# EAGLE design working (EAGLE 9.6.2)
COMPANY: ADAFRUIT INDUSTRIES; DRAWN: KTOWN; REV: A
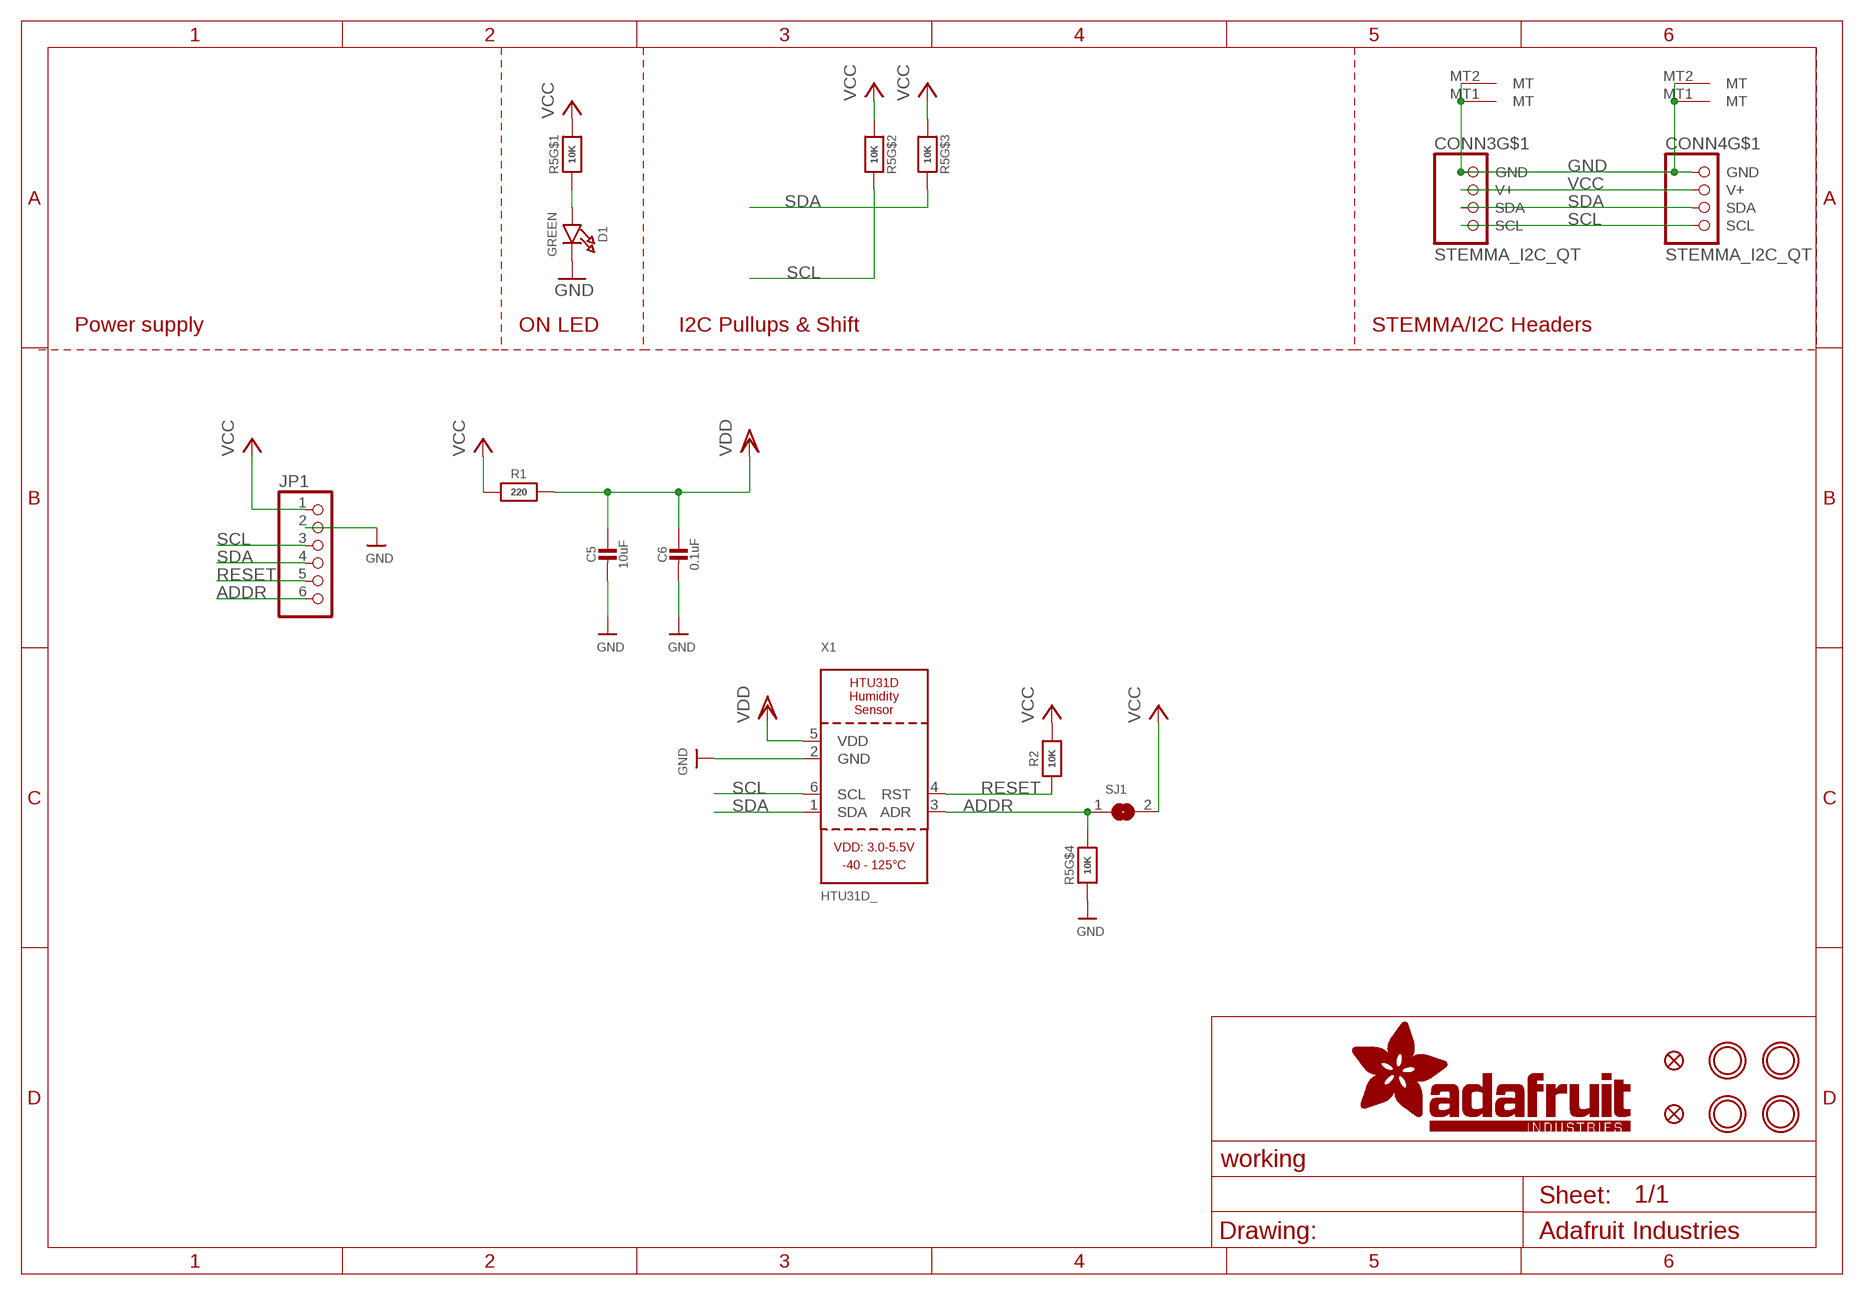
[diagram p0: schematic, sheet 1]

## Parts
C5  10uF  CAP_CERAMIC0805-NOOUTLINE  [0805-NO]
C6  0.1uF  CAP_CERAMIC0603_NO  [0603-NO]
CONN3  STEMMA_I2C_QT  [JST_SH4]
CONN4  STEMMA_I2C_QT  [JST_SH4]
D1  GREEN  LED0603_NOOUTLINE  [CHIPLED_0603_NOOUTLINE]
FID3  FIDUCIAL_1MM  [FIDUCIAL_1MM]
FID4  FIDUCIAL_1MM  [FIDUCIAL_1MM]
JP1  HEADER-1X670MIL  [1X06_ROUND_70]
R1  220  RESISTOR_0603_NOOUT  [0603-NO]
R2  10K  RESISTOR_0603_NOOUT  [0603-NO]
R5  10K  RESISTOR_4PACK  [RESPACK_4X0603]
SJ1  SOLDERJUMPER  [SOLDERJUMPER_ARROW_NOPASTE]
U$19  MOUNTINGHOLE2.5  [MOUNTINGHOLE_2.5_PLATED]
U$20  MOUNTINGHOLE2.5  [MOUNTINGHOLE_2.5_PLATED]
U$22  MOUNTINGHOLE2.5  [MOUNTINGHOLE_2.5_PLATED]
U$25  MOUNTINGHOLE2.5  [MOUNTINGHOLE_2.5_PLATED]
X1  HTU31D_  [HTU31D]

## Nets
ADDR: JP1.6 R5.5 SJ1.1 X1.3(ADR)
GND: C5.2 C6.2 CONN3.1(GND) CONN3.MT1(MT) CONN3.MT2(MT) CONN4.1(GND) CONN4.MT1(MT) CONN4.MT2(MT) D1.C JP1.2 R5.4 X1.2(GND)
N$1: D1.A R5.1
RESET: JP1.5 R2.1 X1.4(RST)
SCL: CONN3.4(SCL) CONN4.4(SCL) JP1.3 R5.7 X1.6(SCL)
SDA: CONN3.3(SDA) CONN4.3(SDA) JP1.4 R5.6 X1.1(SDA)
VCC [highpower]: CONN3.2(V+) CONN4.2(V+) JP1.1 R1.1 R2.2 R5.2 R5.3 R5.8 SJ1.2
VDD: C5.1 C6.1 R1.2 X1.5(VDD)

## Notes on the sheet
- Power supply | ON LED | I2C Pullups & Shift | STEMMA/I2C Headers

## Library data of the parts
C5 C6 = microbuilder:CAP_CERAMIC: Ceramic Capacitors For new designs, use the packages preceded by an '_' character since they are more reliable: The following footprints should be used on most boards: _0402 - Standard footprint for regular board layouts _0603 - Standard footprint for regular board layouts _0805 - Standard footprint for regular board layouts _1206 - Standard footprint for regular board layouts For extremely tight-pitch boards where space is at a premium, the following 'micro-pitch' footprints can be used (smaller pads, no silkscreen outline, etc.): _0402MP - Micro-pitch footprint for very dense/compact boards _0603MP - Micro-pitch footprint for very dense/compact boards _0805MP - Micro-pitch footprint for very dense/compact boards _1206MP - Micro-pitch footprint for very dense/compact boards
CONN3 CONN4 = microbuilder:STEMMA_I2C
D1 = microbuilder:LED: LED 0603 - 0603 Surface Mount Package 2mA: Green LED - Low Power (3.9mcd, 2ma, 1.7Vf) - Digikey: 475-2709-2-ND Orange LED - Low Power (9.8mcd, 2ma, 1.8Vf) - Digikey: 475-1194-2-ND Red LED - Low Power (5mcd, 2ma, 1.8Vf) - Digikey: 475-1195-2-ND Yellow LED - Low Power (7mcd, 2ma, 1.8Vf) - Digikey: 475-1196-2-ND 5mA: Blue LED - Low Power (17mcd, 5ma, 2.9Vf) - Digikey: LNJ937W8CRACT-ND 0805 - 0805 Surface Mount Package 2mA: Red LED (8.8mcd, 2mA, 1.8Vf, Clear) - Low Power [Digikey: 475-2510-1-ND] Green LED (5mcd, 2mA, 1.8Vf, Clear) - Low Power [Digikey: 475-2730-1-ND] Yellow LED (11.3mcd, 2mA, 1.8Vf, Clear) - Low Power [Digikey: 475-2555-1-ND] 20mA: Red LED (104mcd, 20mA, Diffused) - LS R976 [Digikey: 475-1278-6-ND] Red LED (12mcd, 20mA, 2.0Vf, Clear) - APT2012EC [Digikey: 754-1128-1-ND] Green LED (15mcd, 20mA, 2.2Vf, Clear) - APT2012GC [Digikey: 754-1131-1-ND] Orange LED (160mcd, 20mA, 2.1Vf, Clear) - APT2012SECK [Digikey: 754-1130-1-ND] 1206 - 1206 Surface Mount Package Green LED (26mcd, 20mA, Diffused) - LG N971 [Digikey: 475-1407-6-ND] Red LED (15mcd, 20mA, Diffused) - LH N974 [Digikey: 475-1416-6-ND] Cree - Cree High-Power Surface Mount LEDs XPEBWT-L1-0000-00D50 - White 111lm 350mA 2.9Vf 6200K 110° XTEAWT-00-0000-00000LEE3 - White 114lm 350mA 2.85Vf 5000K 115° Everlight - Everlight 45-21 Series Surface Mount LEDs 45-21/QK2C-B2832AC2CB2/2T - Warm White 2000mcd 20mA 3.25Vf 3050K 120° 45-21/LK2C-B38452C4CB2/2T - Nuetral White 2000mcd 20mA 3.25Vf 4150K 120° 45-21/LK2C-B50634C6CB2/2T - Cold White 2200mcd 20mA 3.25Vf 5650K 120° PLCC2 Reverse Mount LS T77K-J1L2-1-0-2-R18-Z - Red 11.25mcd 2mA 1.8Vf 630nm 120° LO T77K-L1M2-24-Z - Orange 19.6mcd 2mA 1.8Vf 606nm 120° LY T77K-K2M1-26-Z - Yellow 15.7mcd 2mA 1.8Vf 587nm 120°
FID3 FID4 = microbuilder:FIDUCIAL: Fiducial Alignment Points Various fiducial points for machine vision alignment.; BOM: EXCLUDE
JP1 = microbuilder:HEADER-1X6: PIN HEADER
R1 R2 = microbuilder:RESISTOR: Resistors For new designs, use the packages preceded by an '_' character since they are more reliable: The following footprints should be used on most boards: _0402 - Standard footprint for regular board layouts _0603 - Standard footprint for regular board layouts _0805 - Standard footprint for regular board layouts _1206 - Standard footprint for regular board layouts For extremely tight-pitch boards where space is at a premium, the following 'micro-pitch' footprints can be used (smaller pads, no silkscreen outline, etc.): _0402MP - Micro-pitch footprint for very dense/compact boards _0603MP - Micro-pitch footprint for very dense/compact boards _0805MP - Micro-pitch footprint for very dense/compact boards _1206MP - Micro-pitch footprint for very dense/compact boards
R5 = microbuilder:RESISTOR_4PACK: Resistor Packs (4 resistors) 4 x 0603 10K 1/16W - Digikey: YC164J-10KCT-ND
SJ1 = microbuilder:SOLDERJUMPER: SMD Solder JUMPER Solder the two pads together to create a connection, or remove the solder to break it. REFLOW - Use this footprint for solder paste and reflow ovens. WAVE - Use this footprint for hand-soldering (larger pads). CLOSED - Has a trace between the two pads to ensure it is closed by default. The trace needs to be cut to disable the jumper, and can be closed again by creating a solder bridge between the two pads.; BOM: EXCLUDE
U$19 U$20 U$22 U$25 = microbuilder:MOUNTINGHOLE: Mounting Hole For #2 screws (0.086"/2.18mm width, 0.094"/2.4mm hole) use 2.5mm; BOM: EXCLUDE
X1 = adafruit_sensor:HTU31D

## Net classes
1 highpower: width 0.305 mm, drill 0.483 mm
2 lowpower: width 0.254 mm, drill 0.483 mm

## Board
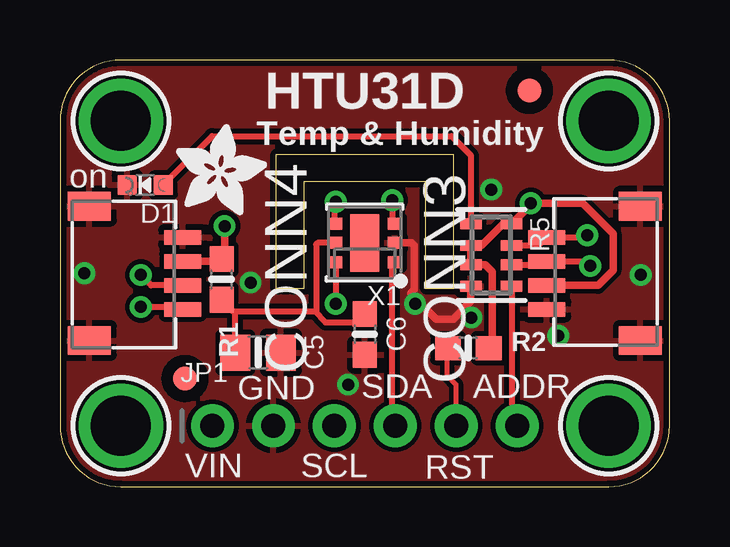
[diagram p1: board, top side]
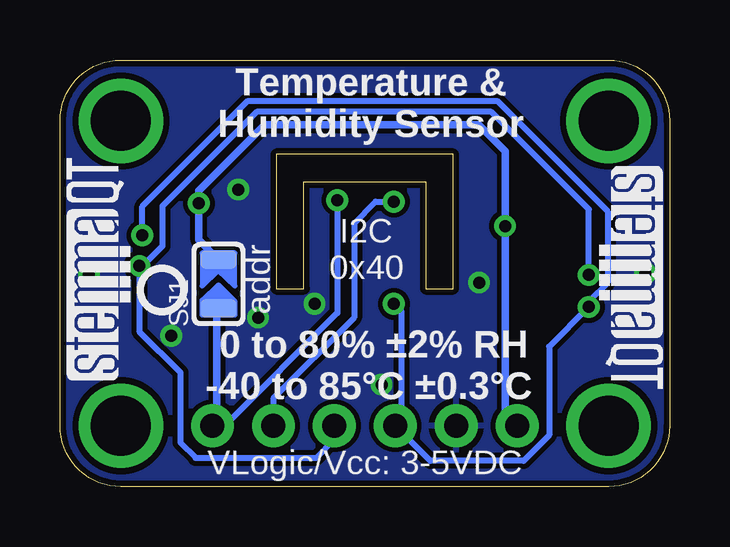
[diagram p2: board, bottom side, seen from below]

Size 25.4 x 17.78 mm. Coordinates in mm from the lower left corner, seen from the top.
Outline: 0,15.24 0,2.54 arc90 2.54,0 22.86,0 arc90 25.4,2.54 25.4,15.24 arc90 22.86,17.78 2.54,17.78 arc90 0,15.24
Outline: 9.02,13.84 16.38,13.84 16.38,8.26 15.24,8.26 15.24,12.7 10.16,12.7 10.16,8.26 9.02,8.26 9.02,13.84
Copper layers (1*16): Top 0.035mm / dielectric 1.5mm / Bottom 0.035mm
Design rules "adafruit": minimum track width 8mil, minimum drill 15.5mil, track to track 8mil, track to pad 8mil, pad to pad 8mil, via to via 8mil, smd to smd 8mil, copper to edge 10mil, drill to drill 8mil, minimum pad ring 10mil, minimum via ring 8mil, stop-mask expansion 2mil, vias tented up to drill 20mil, thermal gap 10mil

### Footprints (pad centres in the part's own frame; a part is rotated, then mirrored left to right if it is on the bottom)
0805-NO = smd 1.24 x 1.5: 1 -0.95,0; 2 0.95,0
0603-NO = smd 1.075 x 1: 1 -0.85,0; 2 0.85,0
JST_SH4 = smd 0.6 x 1.55: 1 -1.5,2.514; 2 -0.5,2.514; 3 0.5,2.514; 4 1.5,2.514 | smd 1.2 x 1.8: MT1 -2.8,-1.386; MT2 2.8,-1.386
CHIPLED_0603_NOOUTLINE = smd 0.8 x 0.8: A 0,-0.75; C 0,0.75
FIDUCIAL_1MM = smd 1 x 1: 1 0,0
1X06_ROUND_70 = drill 1 pad 1.778: 1 -6.35,0; 2 -3.81,0; 3 -1.27,0; 4 1.27,0; 5 3.81,0; 6 6.35,0
RESPACK_4X0603 = smd 0.45 x 0.9: 1 -1.3,-0.85; 2 -0.4,-0.85; 3 0.4,-0.85; 4 1.3,-0.85; 5 1.3,0.85; 6 0.4,0.85; 7 -0.4,0.85; 8 -1.3,0.85
SOLDERJUMPER_ARROW_NOPASTE = smd 0.762 x 1.524: 1 -1.016,0; 2 1.016,0
MOUNTINGHOLE_2.5_PLATED = drill 2.5 pad 3.2: P$1 0,0
HTU31D = smd 0.6 x 0.5: 1 -1.25,0.8; 2 -1.25,0; 3 -1.25,-0.8; 4 1.25,-0.8; 5 1.25,0; 6 1.25,0.8 | smd 1.2 x 2.4: PAD 0,0

### Placement (x,y rotation side)
C5  8.26,5.59 0 top
C6  12.7,6.35 270 top
CONN3  22.8,8.89 90 top
CONN4  2.6,8.89 270 top
D1  3.56,12.57 90 top
FID3  5.21,4.51 0 top
FID4  19.56,16.51 0 top
JP1  12.7,2.54 0 top
R1  6.73,8.64 270 top
R2  17.02,5.78 0 top
R5  17.97,9.65 270 top
SJ1  18.8,8.45 90 bottom
U$19  2.54,15.24 0 top
U$20  22.86,15.24 0 top
U$22  2.54,2.54 0 top
U$25  22.86,2.54 0 top
U$28  [ADAFRUIT_3.5MM]  4.83,11.3 0 top
U$29  [PCBFEAT-REV-040]  21.15,8.19 0 bottom
U$30  [STEMMAQT]  22.48,4.45 90 bottom
U$31  [STEMMAQT]  2.92,13.34 270 bottom
X1  12.7,10.16 180 top

### Tracks (layer width: path | path; a pad name or v marks a point on that pad's centre or on a via)
ADDR  (via drill 0.5)
  Top 0.254: v13.84,11.94 13.84,11.07 X1.3 | R5.5 18.82,2.77 JP1.6
  Bottom 0.254: v13.84,11.94 13.84,7.24 18.54,2.54 | JP1.6 18.54,2.54 | 18.86,2.22 18.54,2.54
  Bottom 0.305: SJ1.1 18.86,7.37 18.86,2.22
GND  (via drill 0.5)
  Top 0.305: X1.2 14.64,10.16 14.77,10.03 14.77,8.23 14.61,8.06 15.68,6.99 16.38,6.99 17.12,7.72 R5.4
  other vias: 1.02,8.89 12,4.25 17.14,7.05 17.97,12.38 24.19,8.83 14.8,7.62 7.94,8.51 20.76,6.29
  pour Top: 0,17.78 25.4,17.78 25.4,0 0,0
  pour Bottom: 0,17.78 25.4,17.78 25.4,0 0,0
N$1
  Top 0.254: D1.A 6.34,14.61 16.32,14.61 17.12,13.8 R5.1
RESET  (via drill 0.5)
  Top 0.203: JP1.5 16.51,4.25 16.13,4.64 16.13,5.74 R2.1
  Top 0.254: X1.4 11.45,11.76 v11.49,11.87
  Bottom 0.254: v11.49,11.87 12.26,11.87 13.14,10.99 13.14,7.05 16.51,3.68 JP1.5
SCL  (via drill 0.5)
  Top 0.254: X1.6 11.49,9.32 v11.49,7.62 | R5.7 19.95,10.05 CONN3.4 21.88,10.39 v21.97,10.48 | v3.37,7.49 5.01,7.49 CONN4.4
  Bottom 0.254: v11.49,7.62 11.18,7.3 11.18,3.37 11.49,3.05 11.49,2.6 JP1.3 9.97,1.08 6.09,1.08 5.02,2.15 5.02,5.84 v3.37,7.49 3.37,7.72 2.58,8.5 2.58,11.47 7.19,16.08 17.58,16.08 21.97,11.68 v21.97,10.48
SDA  (via drill 0.5)
  Top 0.254: JP1.4 13.82,2.69 13.82,9.23 X1.1 | R5.6 20.14,9.25 CONN3.3 21.9,9.39 v22.09,9.2 | CONN4.3 3.8,8.39 v3.37,8.83
  Bottom 0.254: JP1.4 13.97,1.97 14.73,1.21 19.75,1.21 20.38,1.84 20.38,4.76 22.09,6.47 v22.09,9.2 21.96,9.2 21.14,10.02 21.14,11.69 17.21,15.62 7.43,15.62 3.37,11.56 v3.37,8.83
VCC  (via drill 0.5)
  Top 0.305: CONN3.2 22.42,8.39 23.05,9.02 23.05,10.54 21.78,11.81 v19.62,11.81 19.62,11.75 R5.8 18.48,10.95 17.58,10.05 R5.2 R5.3 17.72,9.25 18.02,8.95 18.02,5.92 R2.2 | CONN4.2 6.63,9.39 R1.1 6.86,9.61 v6.86,10.86
  Bottom 0.305: JP1.1 6.86,3.05 v6.86,10.86 6.86,13.99 7.95,15.07 16.87,15.07 19.62,12.32 v19.62,11.81 19.62,10.28 SJ1.2
VDD
  Top 0.254: X1.5 10.73,10.16 10.67,10.1 10.67,7.3 10.6,7.3 | 7.24,7.3 7.21,7.3 R1.2 | C5.1 7.3,7.24 7.24,7.3 | C6.1 12.34,6.84 11.07,6.84 10.6,7.3 | 7.24,7.3 10.6,7.3

### Text on the board
tPlace: HTU31D | Temp & Humidity | on | GND | SDA | ADDR | VIN | SCL | RST
bPlace: Temperature & / Humidity Sensor | I2C / 0x40 | addr | 0 to 80% ±2% RH / -40 to 85°C ±0.3°C | VLogic/Vcc: 3-5VDC